# Altium project TPS54202.PrjPcb
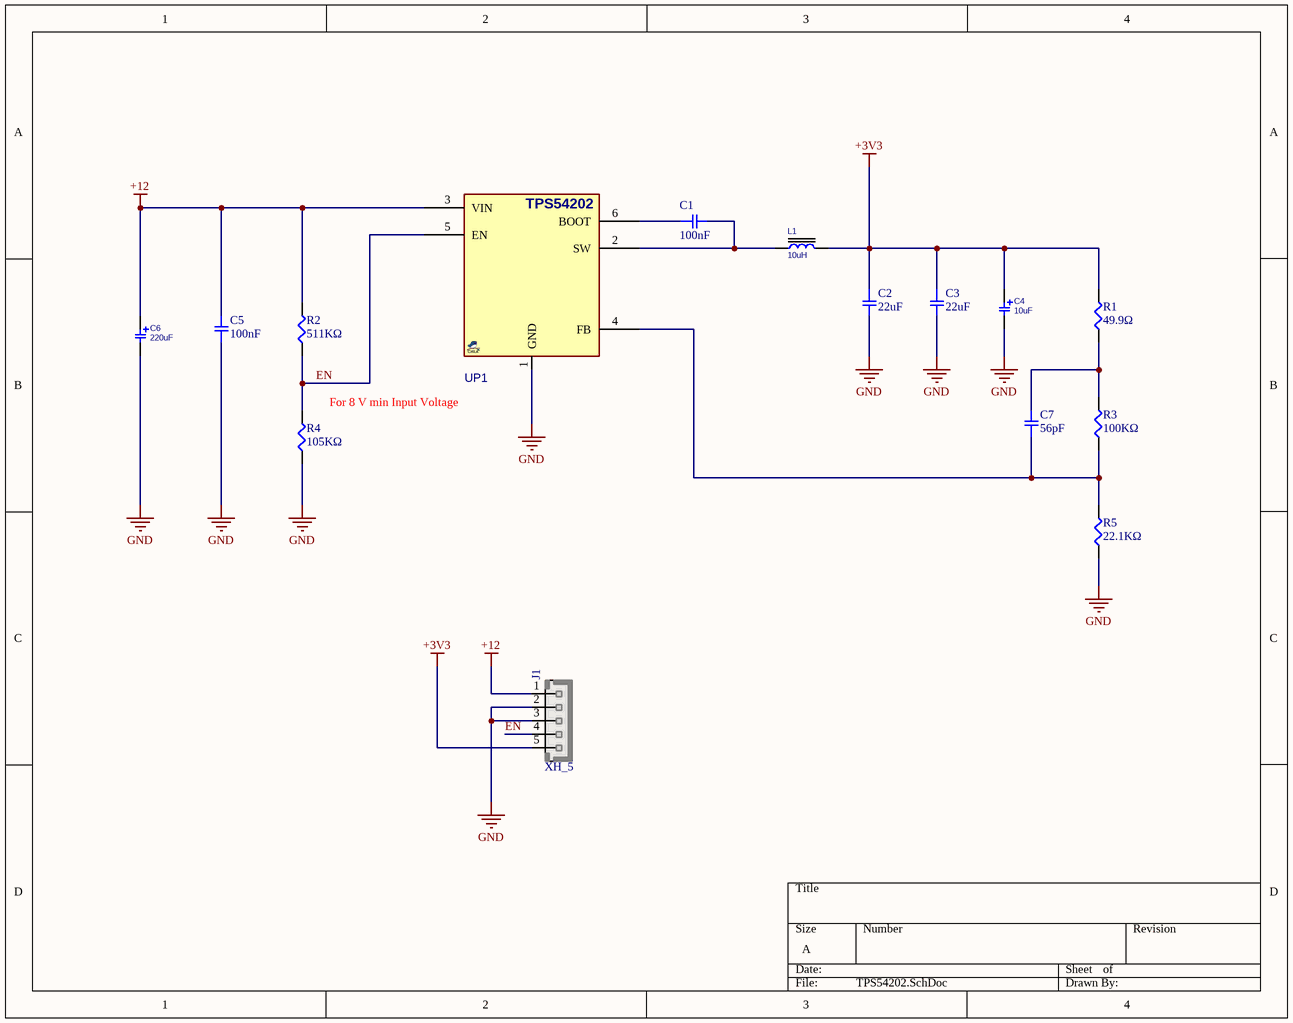
[diagram p0: TPS54202.SchDoc]
1 sheet, 15 parts. Net scope: global (net labels, ports and power ports of the same name join across sheets).
Board file: TPS54202.PcbDoc

## Sheet TPS54202.SchDoc
size A; SheetNumber: 1; SheetTotal: 1

### Parts
C1  100nF  [SMD-0805C]
C2  22uF  [SMD-1206C]
C3  22uF  [SMD-1206C]
C4  10uF  [C_TN_3216]
C5  100nF  [SMD-0805C]
C6  220uF  [C_TN_7343]
C7  56pF  [SMD-0805C]
J1  XH_5  [XH_5]
L1  10uH  [F1812]
R1  49.9Ω  [SMD-0805-RES]
R2  511KΩ  [SMD-0805-RES]
R3  100KΩ  [SMD-0805-RES]
R4  105KΩ  [SMD-0805-RES]
R5  22.1KΩ  [SMD-0805-RES]
UP1  TPS54202  [SOT23_6]  (value not drawn)

### Nets
+3V3: C2.1 C3.1 C4.1 J1.5 L1.2 R1.2
+12: C5.2 C6.1 J1.1 R2.2 UP1.3(VIN)
GND: C2.2 C3.2 C4.2 C5.1 C6.2 J1.2 J1.3 R4.1 R5.1 UP1.1(GND)
EN: J1.4 R2.1 R4.2 UP1.5(EN)
NetC1_1: C1.1 UP1.6(BOOT)
NetC1_2: C1.2 L1.1 UP1.2(SW)
NetC7_1: C7.1 R3.1 R5.2 UP1.4(FB)
NetC7_2: C7.2 R1.1 R3.2

### Notes on the sheet
- For 8 V min Input Voltage

### Library data of the parts
C1 C5 C7 = GC321AD72E103KX01D: CAP CER 100nF 50V X7T 0805; Manufacturer: Murata Electronics North America; Factory Stock: 0; Unit Price (USD): 0.3; Minimum Quantity: 1; Value: 10000pF; Tolerance: ±10%; Voltage: 250V; Datasheets: http://search.murata.co.jp/Ceramy/image/img/A01X/G101/ENG/GC321AD72E103KX01-01.pdf; Image: //media.digikey.com/Renders/Murata%20Renders/0805(GC3)200x125.jpg; Digi-Key Part Number: 490-13986-1-ND; Part Number: GC321AD72E103KX01D; Quantity Available: 4000; @ qty: 0; Packaging: Cut Tape (CT); Series: GC3; Part Status: Active; Temperature Coefficient: X7T; Operating Temperature: -55°C ~ 125°C; Features: -; Ratings: AEC-Q200; Applications: Automotive; Mounting Type: Surface Mount, MLCC; Package / Case: 0805 (2012 Metric); Size / Dimension: 0.079" L x 0.049" W (2.00mm x 1.25mm); Height - Seated (Max): -; Thickness (Max): 0.039" (1.00mm); Lead Spacing: -; Lead Style: -
C2 C3 = GC331AD72E333KX01D: CAP CER 22UF 50V X5R 1206; Manufacturer: Murata Electronics North America; Factory Stock: 0; Unit Price (USD): 0.33; Minimum Quantity: 1; Value: 0.033µF; Tolerance: ±10%; Voltage: 250V; Temperature Coefficient: X7T; Datasheets: http://search.murata.co.jp/Ceramy/image/img/A01X/G101/ENG/GC331AD72E333KX01-01.pdf; Image: //media.digikey.com/Renders/Murata%20Renders/1206(GC3)320x160.jpg; Digi-Key Part Number: 490-13989-1-ND; Part Number: GC331AD72E333KX01D; Quantity Available: 3999; @ qty: 0; Packaging: Cut Tape (CT); Series: GC3; Part Status: Active; Operating Temperature: -55°C ~ 125°C; Features: -; Ratings: AEC-Q200; Applications: Automotive; Mounting Type: Surface Mount, MLCC; Package / Case: 1206 (3216 Metric); Size / Dimension: 0.126" L x 0.063" W (3.20mm x 1.60mm); Height - Seated (Max): -; Thickness (Max): 0.039" (1.00mm); Lead Spacing: -; Lead Style: -
C4 = CAP_SMD_TAN_10uF_6.3V: CAP, SMD, TAN; PARAM: 20%, 300mOhm, -55~105oC; MANF: VISHAY; MANF_P#: T55A106M6R3C0300; PARAM2: 6.3V; PRICE: 0.46$; VALUE: 10uF
C6 = CAP_SMD_TAN_220uF: CAP, SMD, TAN; PARAM: 20%, 35mOhm, -55~105oC; MANF: VISHAY; MANF_P#: T55D227M6R3C0035; PARAM2: 6.3V; PRICE: 1.9$; VALUE: 220uF
J1 = XH_5: JST-XH pitch: 2.5mm; MANF_P#: JST-B5B-XHA; MANF: JST; VALUE: XH_5
L1 = IND_SMD_10uH_2A: INDUCTOR, 10uH 2A, 38mOhm, 2626; PARAM: 2A Irms, 2.05A Isat; MANF_P#: SRR6038-100Y; MANF: Bourns; PRICE: 2.5$; DESC: INDUCTOR, 10uH 2A, 38mOhm, 2626; PARAM2: 38mOhm; ASSEMBLY: ASSEMBLY; VALUE: 10uH
R1 = ERJ-6BQF1R0V: 49.9Ω / 0805; Manufacturer: Panasonic Electronic Components; Factory Stock: 0; Unit Price (USD): 0.05834; @ qty: 1500; Minimum Quantity: 1; Value: 1; Tolerance: ±1%; Power (Watts): 0.333W, 1/3W; Temperature Coefficient: ±200ppm/°C; Part Number: ERJ-6BQF1R0V; Datasheets: https://industrial.panasonic.com/cdbs/www-data/pdf/RDA0000/AOA0000C239.pdf; Image: //media.digikey.com/Renders/Panasonic%20Renders/ERJ-0805%20Pkg.jpg; Digi-Key Part Number: P17499CT-ND; Quantity Available: 808; Packaging: Cut Tape (CT); Series: ERJ; Part Status: Active; Composition: Thick Film; Features: Automotive AEC-Q200, Current Sense; Operating Temperature: -55°C ~ 125°C; Package / Case: 0805 (2012 Metric); Supplier Device Package: 0805; Size / Dimension: 0.079" L x 0.049" W (2.00mm x 1.25mm); Height - Seated (Max): 0.028" (0.70mm); Number of Terminations: 2; Failure Rate: -
R2 = ERJ-6BQF1R0V: 511K 0805; Manufacturer: Panasonic Electronic Components; Factory Stock: 0; Unit Price (USD): 0.05834; @ qty: 1500; Minimum Quantity: 1; Value: 1; Tolerance: ±1%; Power (Watts): 0.333W, 1/3W; Temperature Coefficient: ±200ppm/°C; Part Number: ERJ-6BQF1R0V; Datasheets: https://industrial.panasonic.com/cdbs/www-data/pdf/RDA0000/AOA0000C239.pdf; Image: //media.digikey.com/Renders/Panasonic%20Renders/ERJ-0805%20Pkg.jpg; Digi-Key Part Number: P17499CT-ND; Quantity Available: 808; Packaging: Cut Tape (CT); Series: ERJ; Part Status: Active; Composition: Thick Film; Features: Automotive AEC-Q200, Current Sense; Operating Temperature: -55°C ~ 125°C; Package / Case: 0805 (2012 Metric); Supplier Device Package: 0805; Size / Dimension: 0.079" L x 0.049" W (2.00mm x 1.25mm); Height - Seated (Max): 0.028" (0.70mm); Number of Terminations: 2; Failure Rate: -
R3 = ERJ-6BQF1R0V: 100KΩ / 0805; Manufacturer: Panasonic Electronic Components; Factory Stock: 0; Unit Price (USD): 0.05834; @ qty: 1500; Minimum Quantity: 1; Value: 1; Tolerance: ±1%; Power (Watts): 0.333W, 1/3W; Temperature Coefficient: ±200ppm/°C; Part Number: ERJ-6BQF1R0V; Datasheets: https://industrial.panasonic.com/cdbs/www-data/pdf/RDA0000/AOA0000C239.pdf; Image: //media.digikey.com/Renders/Panasonic%20Renders/ERJ-0805%20Pkg.jpg; Digi-Key Part Number: P17499CT-ND; Quantity Available: 808; Packaging: Cut Tape (CT); Series: ERJ; Part Status: Active; Composition: Thick Film; Features: Automotive AEC-Q200, Current Sense; Operating Temperature: -55°C ~ 125°C; Package / Case: 0805 (2012 Metric); Supplier Device Package: 0805; Size / Dimension: 0.079" L x 0.049" W (2.00mm x 1.25mm); Height - Seated (Max): 0.028" (0.70mm); Number of Terminations: 2; Failure Rate: -
R4 = ERJ-6BQF1R0V: 105KΩ 0805; Manufacturer: Panasonic Electronic Components; Factory Stock: 0; Unit Price (USD): 0.05834; @ qty: 1500; Minimum Quantity: 1; Value: 1; Tolerance: ±1%; Power (Watts): 0.333W, 1/3W; Temperature Coefficient: ±200ppm/°C; Part Number: ERJ-6BQF1R0V; Datasheets: https://industrial.panasonic.com/cdbs/www-data/pdf/RDA0000/AOA0000C239.pdf; Image: //media.digikey.com/Renders/Panasonic%20Renders/ERJ-0805%20Pkg.jpg; Digi-Key Part Number: P17499CT-ND; Quantity Available: 808; Packaging: Cut Tape (CT); Series: ERJ; Part Status: Active; Composition: Thick Film; Features: Automotive AEC-Q200, Current Sense; Operating Temperature: -55°C ~ 125°C; Package / Case: 0805 (2012 Metric); Supplier Device Package: 0805; Size / Dimension: 0.079" L x 0.049" W (2.00mm x 1.25mm); Height - Seated (Max): 0.028" (0.70mm); Number of Terminations: 2; Failure Rate: -
R5 = ERJ-6BQF1R0V: 22.1KΩ  0805; Manufacturer: Panasonic Electronic Components; Factory Stock: 0; Unit Price (USD): 0.05834; @ qty: 1500; Minimum Quantity: 1; Value: 1; Tolerance: ±1%; Power (Watts): 0.333W, 1/3W; Temperature Coefficient: ±200ppm/°C; Part Number: ERJ-6BQF1R0V; Datasheets: https://industrial.panasonic.com/cdbs/www-data/pdf/RDA0000/AOA0000C239.pdf; Image: //media.digikey.com/Renders/Panasonic%20Renders/ERJ-0805%20Pkg.jpg; Digi-Key Part Number: P17499CT-ND; Quantity Available: 808; Packaging: Cut Tape (CT); Series: ERJ; Part Status: Active; Composition: Thick Film; Features: Automotive AEC-Q200, Current Sense; Operating Temperature: -55°C ~ 125°C; Package / Case: 0805 (2012 Metric); Supplier Device Package: 0805; Size / Dimension: 0.079" L x 0.049" W (2.00mm x 1.25mm); Height - Seated (Max): 0.028" (0.70mm); Number of Terminations: 2; Failure Rate: -
UP1 = VREG_TPS54202_SOT23-6: REG, Switching, Buck, 2A, ADJ, 0.5MHz, 4.5~28VIN, SOT23-6; MANF: TI; PARAM: 2A, 0.5MHz, -40~125oC; PARAM2: 4.5~28VIN, ADJ, 148mΩ RDSon; MANF_P#: TPS54202DDC, TPS54202HDDC; ASSEMBLY: ASSEMBLY; PRICE: 2200t@LION; VALUE: TPS54202